# Altium schematic sheet ArbPwrBoost_P7.SchDoc: =ProjectTitle
size B; Engineer: Hab Collector; Organization: Altium Limited; Address1: 3621 Gin Way; Address2: Snellville, GA 30039; SheetNumber: 7; SheetTotal: 8
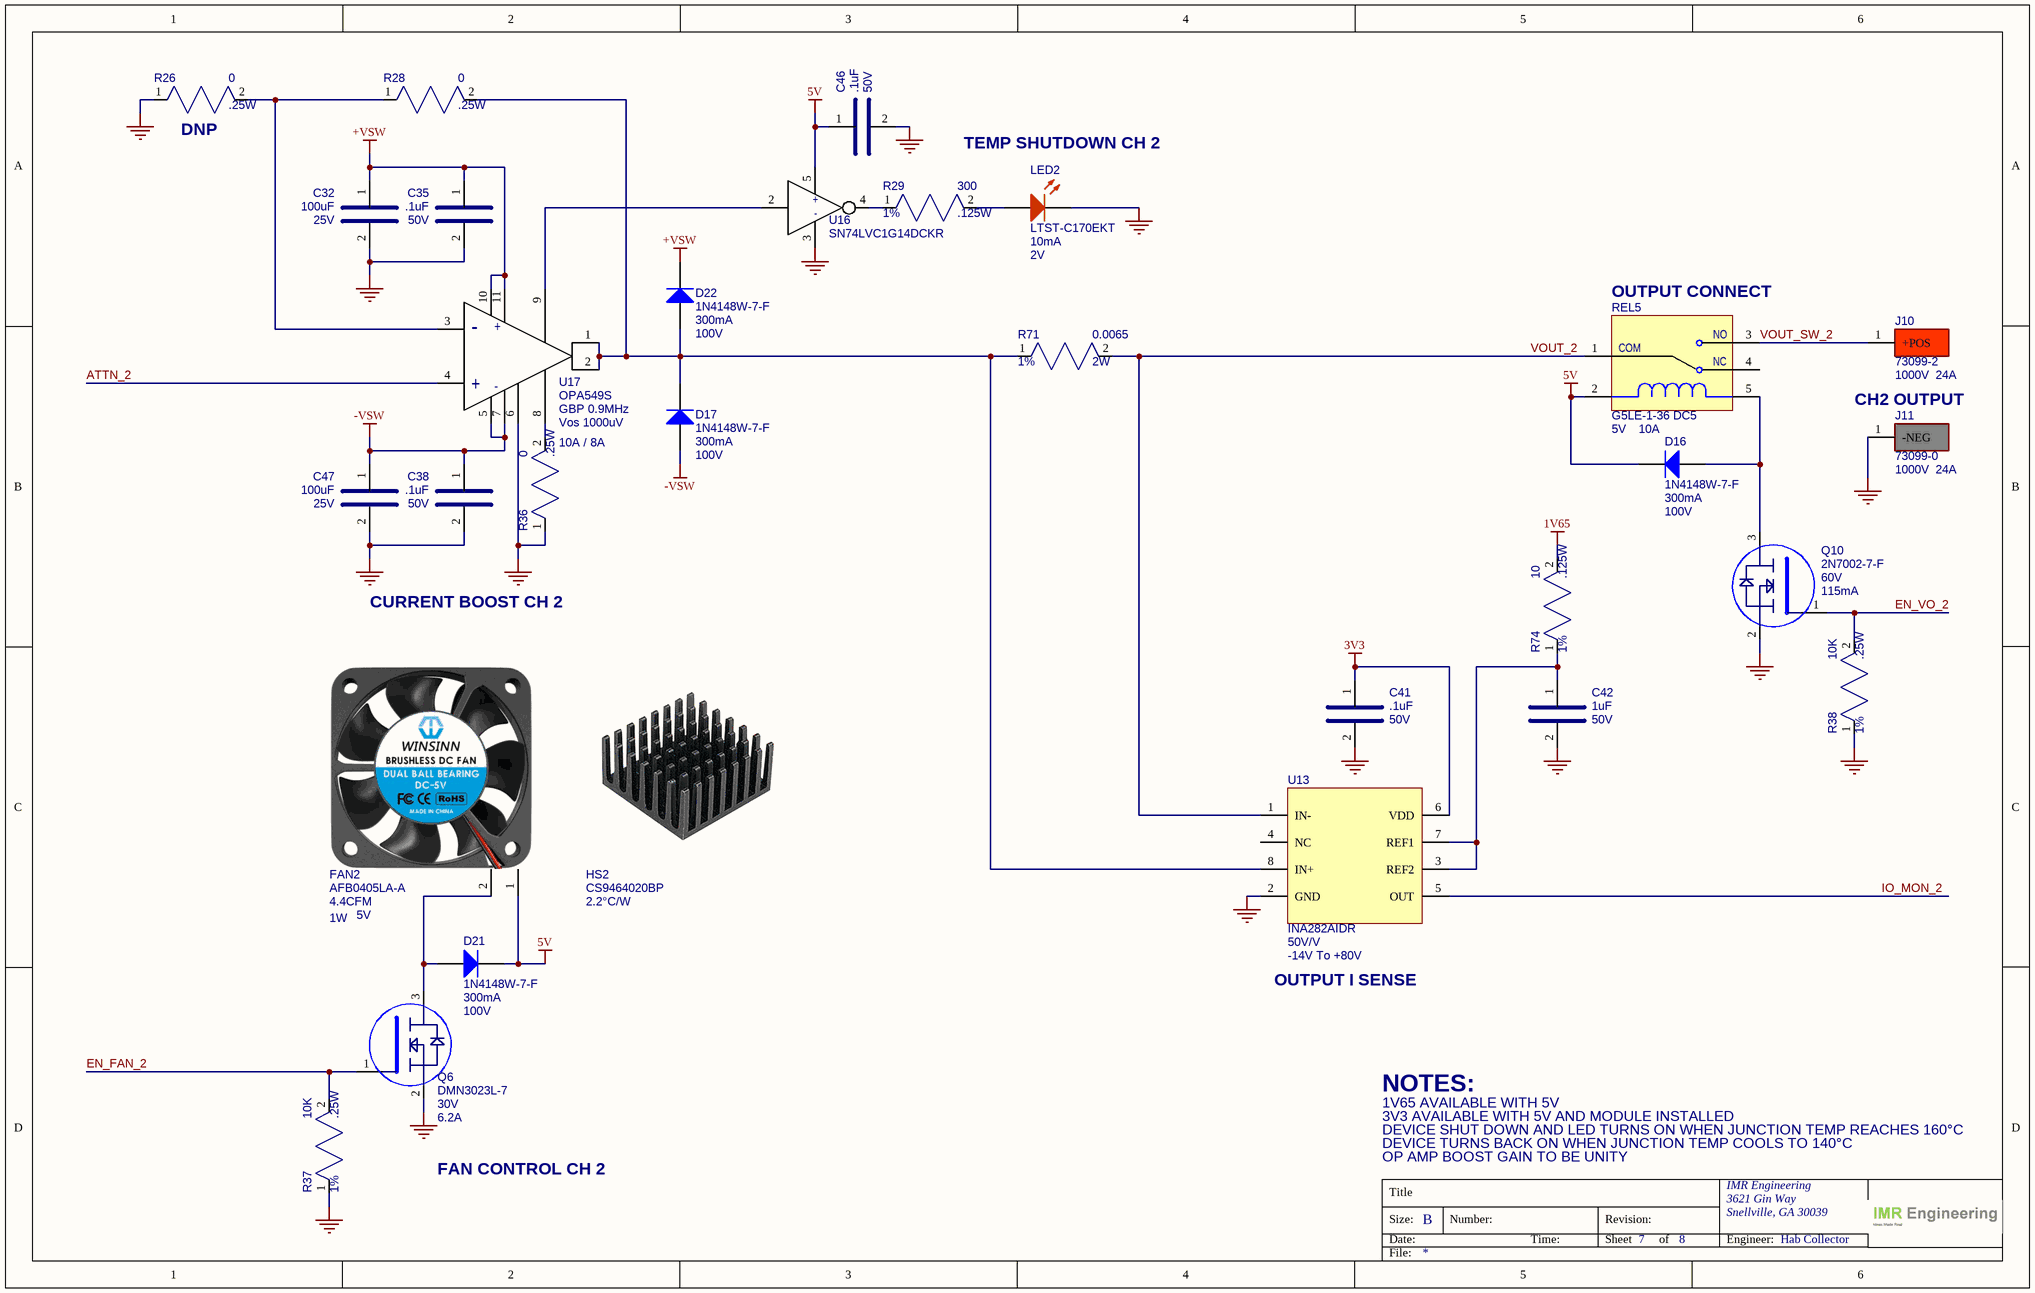
[diagram p0: ArbPwrBoost_P7.SchDoc]

## Parts
C32  value 100uF  Voltage: 25V  [CAPC6153X670N]  (hidden comment: KCM55WC71E107MH13L)
C35  value .1uF  Voltage: 50V  [CAP_0805]  (hidden comment: KGM21NR71H104KT)
C38  value .1uF  Voltage: 50V  [CAP_0805]  (hidden comment: KGM21NR71H104KT)
C41  value .1uF  Voltage: 50V  [CAP_0805]  (hidden comment: KGM21NR71H104KT)
C42  value 1uF  Voltage: 50V  [CAP_0805]  (hidden comment: 08055C105K4T2A)
C46  value .1uF  Voltage: 50V  [CAP_0805]  (hidden comment: KGM21NR71H104KT)
C47  value 100uF  Voltage: 25V  [CAPC6153X670N]  (hidden comment: KCM55WC71E107MH13L)
D16  value 100V  Current: 300mA  [SOD123]  (hidden comment: 1N4148W-7-F)
D17  value 100V  Current: 300mA  [SOD123]  (hidden comment: 1N4148W-7-F)
D21  value 100V  Current: 300mA  [SOD123]  (hidden comment: 1N4148W-7-F)
D22  value 100V  Current: 300mA  [SOD123]  (hidden comment: 1N4148W-7-F)
FAN2  Air Flow: 4.4CFM  Voltage: 5V  Power: 1W  [FAN_AFB0405LA-A]  (hidden comment: AFB0405LA-A)
HS2  Thermal Resistance: 2.2°C/W  [HEATSINK_CS9464020BP]  (hidden comment: CS9464020BP)
J10  value 1000V  Current: 24A  [Pomona_73099-2]  (hidden comment: 73099-2)
J11  value 1000V  Current: 24A  [Pomona_73099-0]  (hidden comment: 73099-0)
LED2  value 2V  Current: 10mA  [LED_0805]  (hidden comment: LTST-C170EKT)
Q6  value 30V  Current: 6.2A  [SOT-23]  (hidden comment: DMN3023L-7)
Q10  value 60V  Current: 115mA  [SOT-23]  (hidden comment: 2N7002-7-F)
R26  value 0  Power: .25W  [RES_0805]  (hidden comment: RC0805JR-070RL)
R28  value 0  Power: .25W  [RES_0805]  (hidden comment: RC0805JR-070RL)
R29  value 300  Power: .125W  Tolerance: 1%  [RES_0805]  (hidden comment: RC0805FR-07300RL)
R36  value 0  Power: .25W  [RES_0805]  (hidden comment: RC0805JR-070RL)
R37  value 10K  Power: .25W  Tolerance: 1%  [RES_0805]  (hidden comment: RC0805FR-7W10KL)
R38  value 10K  Power: .25W  Tolerance: 1%  [RES_0805]  (hidden comment: RC0805FR-7W10KL)
R71  value 0.0065  Tolerance: 1%  Power: 2W  [RES_2512]  (hidden comment: WSL25126L500FEA18)
R74  value 10  Power: .125W  Tolerance: 1%  [RES_0805]  (hidden comment: RC0805FR-1310RL)
REL5  value 5V  Current: 10A  [G5LE]  (hidden comment: G5LE-1-36 DC5)
U13  value 50V/V  Common Mode: -14V To +80V  [SOIC-8_54]  (hidden comment: INA282AIDR)
U16  SN74LVC1G14DCKR  [SOT-353]
U17  value GBP 0.9MHz  Vos: Vos 1000uV  Peak / Contineous Current: 10A / 8A  [POWER_PACKAGE_11]  (hidden comment: OPA549S)

## Nets
1V65: R74.2
3V3: C41.1 U13.6(VDD)
5V: C46.1 D16.2(K) D21.2(K) FAN2.1 REL5.2 U16.5
+VSW: C32.1 C35.1 D22.2(K) U17.10 U17.11
-VSW: C38.1 C47.1 D17.1(A) U17.5 U17.7
GND: C32.2 C35.2 C38.2 C41.2 C42.2 C46.2 C47.2 J11.1(-NEG) LED2.K Q6.2(E) Q10.2(E) R26.1 R36.1 R37.1 R38.1 U13.2(GND) U16.3 U17.6
ATTN_2: U17.4(+)
EN_FAN_2: Q6.1(B) R37.2
EN_VO_2: Q10.1(B) R38.2
IO_MON_2: U13.5(OUT)
VOUT_2: R71.2 REL5.1(COM) U13.1(IN-)
VOUT_SW_2: J10.1(+POS) REL5.3(NO)
NetC42_1: C42.1 R74.1 U13.3(REF2) U13.7(REF1)
NetD16_1: D16.1(A) Q10.3(C) REL5.5
NetD17_2: D17.2(K) D22.1(A) R28.2 R71.1 U13.8(IN+) U17.1 U17.2
NetD21_1: D21.1(A) FAN2.2 Q6.3(C)
NetLED2_A: LED2.A R29.2
NetR26_2: R26.2 R28.1 U17.3(-)
NetR29_1: R29.1 U16.4(Y)
NetR36_2: R36.2 U17.8
NetU16_2: U16.2(A) U17.9

Not connected (* = marked no-connect by the designer): REL5 4(NC); U13 4(NC)

## Notes on the sheet
- (near R26) DNP
- TEMP SHUTDOWN CH 2
- (near REL5) OUTPUT CONNECT
- (near J11) CH2 OUTPUT
- CURRENT BOOST CH 2
- OUTPUT I SENSE
- NOTES:
- 1V65 AVAILABLE WITH 5V
- FAN CONTROL CH 2
- 3V3 AVAILABLE WITH 5V AND MODULE INSTALLED
- DEVICE SHUT DOWN AND LED TURNS ON WHEN JUNCTION TEMP REACHES 160°C
- DEVICE TURNS BACK ON WHEN JUNCTION TEMP COOLS TO 140°C
- OP AMP BOOST GAIN TO BE UNITY
- Title
- Size:
- Date:
- B
- Number:
- Time:
- Revision:
- Sheet
- of
- IMR Engineering
- Engineer:
- File:
- (in symbol IC_SN74LVC1G14DCKR) +; -

## Library data of the parts
C32 C47 = CAP_SMD_100UF_25V_SMD: CAP CER 100UF 25V X7S SMD; MFG: Murata Electronics; Case/Package: CAPC6153X670N; MFG_PN: KCM55WC71E107MH13L; Supplier 1: DigiKey; Supplier Part Number 1: 490-KCM55WC71E107MH13LCT-ND; Unit Price: 5.68
C35 C38 C41 C46 = CAP_SMD_0.1UF_50V_0805: CAP CER 0.1UF 50V X7R 0805; MFG: KYOCERA AVX; Case/Package: 0805; MFG_PN: KGM21NR71H104KT; Supplier 1: DigiKey; Supplier Part Number 1: 478-KGM21NR71H104KTCT-ND; Unit Price: .1
C42 = CAP_SMD_1UF_50V_0805: CAP CER 1UF 50V X7R 0805; MFG: KYOCERA AVX; Case/Package: 0805; MFG_PN: 08055C105K4T2A; Supplier 1: DigiKey; Supplier Part Number 1: 478-KAM21KR71H105KUCT-ND; Unit Price: .27
D16 D17 D21 D22 = DIODE_1N4148W-7-F: RELAY REED SPDT 250MA 5V; MFG: Diodes Inc; Case/Package: SOD-123; Supplier 1: DigiKey; Supplier Part Number 1: 1N4148W-FDICT-ND; Unit Price: .16; MFG_PN: 1N4148W-7-F
FAN2 = FAN_AFB0405LA-A: FAN AXIAL 40X10MM BALL 5VDC WIRE; MFG: Delta Electronicis; Case/Package: 40x40x10mm; Supplier 1: DigiKey; Supplier Part Number 1: 603-2014-ND; Unit Price: 7.31; MFG_PN: AFB0405LA-A
HS2 = HEATSINK_CS9464020BP: Heat Sink Aluminum Top Mount; MFG: Cooling Source; Case/Package: 40x40x20mm; Supplier 1: DigiKey; Supplier Part Number 1: 4165-CS9464020BP-ND; Unit Price: 3.41; MFG_PN: CS9464020BP
J10 = CONN_PANOMA_73099-2: CONN 4mm Banana Socket Right Angle PCB RED; MFG: Pomona; Case/Package: 73099-2; Supplier 1: DigiKey; Supplier Part Number 1: 501-73099-2-ND; Unit Price: 10.39; MFG_PN: 73099-2
J11 = CONN_PANOMA_73099-0: CONN 4mm Banana Socket Right Angle PCB BLK; MFG: Pomona; Case/Package: 73099-0; Supplier 1: DigiKey; Supplier Part Number 1: 501-73099-0-ND; Unit Price: 10.39; MFG_PN: 73099-0
LED2 = LED_RED_LTST-C170EKT: LED RED CLEAR SMD; MFG: Diodes Inc; Case/Package: 0805; Supplier 1: DigiKey; Supplier Part Number 1: 160-1178-1-ND; Unit Price: .18; MFG_PN: LTST-C170EKT
Q6 = MOSFET_NCH_DMN3023L-7: MOSFET N-CH 30V 6.2A SOT23-3; MFG: Diodes Inc; Case/Package: SOT-23; Supplier 1: DigiKey; Supplier Part Number 1: DMN3023L-7DICT-ND; Unit Price: .48; MFG_PN: DMN3023L-7
Q10 = MOSFET_NCH_2N7002-7-F: MOSFET N-CH 60V 115MA SOT23-3; MFG: Diodes Inc; Case/Package: SOT-23; Supplier 1: DigiKey; Supplier Part Number 1: 2N7002-FDICT-ND; Unit Price: .20; MFG_PN: 2N7002-7-F
R26 R28 R36 = RES_SMD_0_0805_1/8W_1%: RES SMD 0 OHM 1% 1/8W 0805; MFG: Yageo; Case/Package: 0805; MFG_PN: RC0805JR-070RL; Supplier 1: DigiKey; Supplier Part Number 1: 311-0.0ARCT-ND; Unit Price: .1; Tolerance: 1%
R29 = RES_SMD_300_0805_1/8W_1%: RES SMD 300 OHM 1% 1/8W 0805; MFG: Yageo; Case/Package: 0805; MFG_PN: RC0805FR-07300RL; Supplier 1: DigiKey; Supplier Part Number 1: 311-300CRCT-ND; Unit Price: .1
R37 R38 = RES_SMD_10K_0805_1/4W_1%: RES SMD 10K OHM 1% 1/4W 0805; MFG: Yageo; Case/Package: 0805; MFG_PN: RC0805FR-7W10KL; Supplier 1: DigiKey; Supplier Part Number 1: 13-RC0805FR-7W10KLCT-ND; Unit Price: .10
R71 = RES_SMD_0.0065_2512_2W_1%: RES SMD 0.0065 OHM 1% 2W 2512; MFG: Vishay Dale; Case/Package: 2512; MFG_PN: WSL25126L500FEA18; Supplier 1: DigiKey; Supplier Part Number 1: 541-WSL25126L500FEA18CT-ND; Unit Price: 1.76
R74 = RES_SMD_10_0805_1/8W_1%: RES SMD 10 OHM 1% 1/8W 0805; MFG: Yageo; Case/Package: 0805; MFG_PN: RC0805FR-1310RL; Supplier 1: DigiKey; Supplier Part Number 1: 13-RC0805FR-1310RLCT-ND; Unit Price: .1
REL5 = RELAY_G5LE-1-36 DC5: RELAY GEN PURPOSE SPDT 10A 5V; MFG: Omron; Case/Package: G5LE; Supplier 1: DigiKey; Supplier Part Number 1: G5LE-1-36DC5-ND; Unit Price: 1.24; Supplier: DigiKey; Manufacturer: Omron; MFG_PN: G5LE-1-36 DC5
U13 = IC_INA282AIDR: IC CURRENT SENSE 0.4% 50V/V SOIC-8; MFG: Texas Instruments; Case/Package: SOIC-8; Supplier 1: DigiKey; Supplier Part Number 1: 296-27820-1-ND; Unit Price: 4.13; MFG_PN: INA282AIDR
U16 = IC_SN74LVC1G14DCKR: IC INVERT SCHMITT 1CH 1IN SC70-5; MFG: Texas Instruments; Unit Price: .10; Package/Case: SC70-5; Supplier 1: DigiKey; Supplier Part Number 1: 296-11608-1-ND; MFG_PN: SN74LVC1G14DCKR
U17 = OPAMP_OPA549S: IC OPAMP POWER 1 CIRC 11PWRPACK; MFG: Texas Instruments; Unit Price: 26.94; Package/Case: Power Package-11; Supplier 1: DigiKey; Supplier Part Number 1: OPA549S-ND; MFG_PN: OPA549S